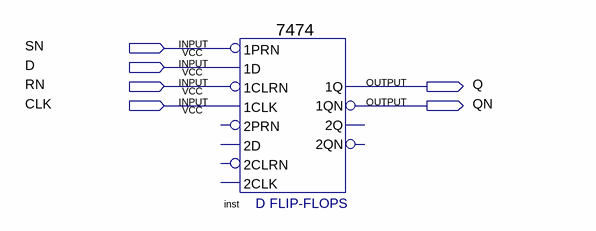
[diagram p0: schematic sheet]
// Quartus schematic D.bdf as structural Verilog: 1 symbols, 6 pins
module D (
  input  SN,
  input  D,
  input  RN,
  input  CLK,
  output Q,
  output QN
);

  \7474  inst (
    .\1CLK (CLK), .\1D (D), .\1PRN (SN), .\1CLRN (RN), .\1QN (QN), .\1Q (Q));  // open: 2D, 2PRN, 2CLK, 2CLRN, 2Q, 2QN
endmodule
